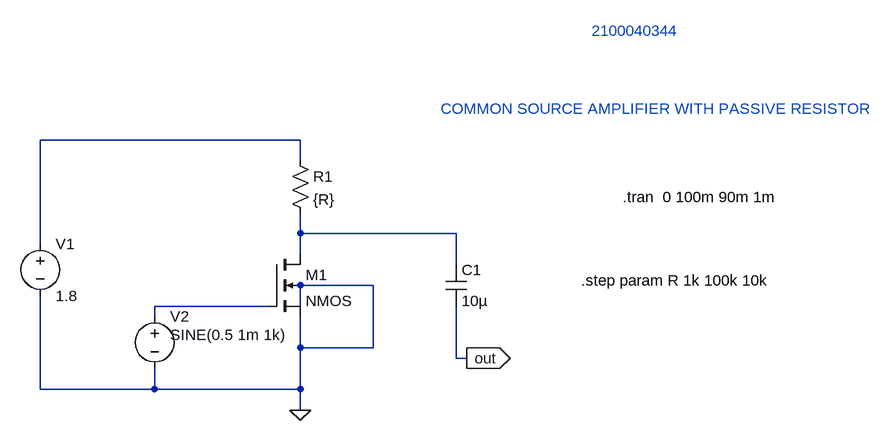
[diagram p0: schematic COMMON SOURCE AMPLIFIER WITH PASSIVE RESISTOR.asc]
COMMON SOURCE AMPLIFIER WITH PASSIVE RESISTOR.asc, the LTspice schematic file:
Version 4
SHEET 1 1168 680
WIRE 256 -48 -144 -48
WIRE 256 -16 256 -48
WIRE 256 96 256 64
WIRE 496 96 256 96
WIRE -144 112 -144 -48
WIRE 256 128 256 96
WIRE 496 144 496 96
WIRE 368 176 256 176
WIRE 208 208 32 208
WIRE 256 208 256 176
WIRE 256 208 240 208
WIRE 32 224 32 208
WIRE 256 272 256 224
WIRE 368 272 368 176
WIRE 368 272 256 272
WIRE 496 288 496 208
WIRE 512 288 496 288
WIRE -144 336 -144 192
WIRE 32 336 32 304
WIRE 32 336 -144 336
WIRE 256 336 256 272
WIRE 256 336 32 336
WIRE 256 368 256 336
FLAG 256 368 0
FLAG 512 288 out
IOPIN 512 288 Out
SYMBOL nmos4 208 128 R0
SYMATTR InstName M1
SYMATTR Value2 l=0.18u w=18u
SYMBOL voltage -144 96 R0
SYMATTR InstName V1
SYMATTR Value 1.8
SYMBOL voltage 32 208 R0
WINDOW 3 24 44 Left 2
WINDOW 123 24 72 Left 2
WINDOW 39 24 72 Left 2
SYMATTR Value SINE(0.5 1m 1k)
SYMATTR InstName V2
SYMBOL res 240 -32 R0
SYMATTR InstName R1
SYMATTR Value {R}
SYMBOL cap 480 144 R0
SYMATTR InstName C1
SYMATTR Value 10µ
TEXT 688 168 Left 2 !.step param R 1k 100k 10k
TEXT 472 -96 Left 2 ;COMMON SOURCE AMPLIFIER WITH PASSIVE RESISTOR
TEXT 704 -216 Left 2 ;2100040344
TEXT 752 40 Left 2 !.tran  0 100m 90m 1m

The netlist it stands for:
* COMMON SOURCE AMPLIFIER WITH PASSIVE RESISTOR.asc
M1 N002 N003 0 0 NMOS l=0.18u w=18u
V1 N001 0 1.8
V2 N003 0 SINE(0.5 1m 1k)
R1 N001 N002 {R}
C1 N002 out 10µ
.model NMOS NMOS
.model PMOS PMOS
.lib standard.mos
.step param R 1k 100k 10k
* COMMON SOURCE AMPLIFIER WITH PASSIVE RESISTOR
* 2100040344
.tran  0 100m 90m 1m
.backanno
.end